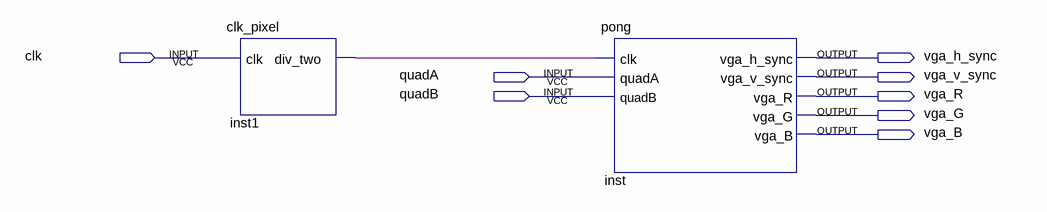
[diagram p0: schematic sheet]
// Quartus schematic testeverilog.bdf as structural Verilog: 2 symbols, 8 pins
module testeverilog (
  input  clk,
  input  quadA,
  input  quadB,
  output vga_h_sync,
  output vga_v_sync,
  output vga_R,
  output vga_G,
  output vga_B
);

  wire inst1_div_two;

  clk_pixel inst1 (.clk(clk), .div_two(inst1_div_two));
  pong inst (
    .clk(inst1_div_two), .quadA(quadA), .quadB(quadB), .vga_h_sync(vga_h_sync), .vga_v_sync(vga_v_sync),
    .vga_R(vga_R), .vga_G(vga_G), .vga_B(vga_B));
endmodule
